# EAGLE schematic F14_01 copy (EAGLE 7.5.0)
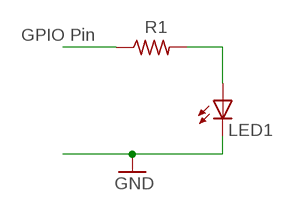
[diagram p0: schematic, sheet 1]

## Parts
LED1  LED-3MM-NO_SILK  [LED3MM-NS]
R1  R-US_0411/3V  [0411V]

## Nets
GND: LED1.K(C)
N$1: LED1.A R1.2
N$2: R1.1

## Notes on the sheet
- GPIO Pin

## Library data of the parts
LED1 = BOOK:LED: LEDs Standard schematic elements and footprints for 5mm, 3mm, 1206, and 0603 sized LEDs. 5mm - Spark Fun Electronics SKU : COM-00529 (and others)
R1 = BOOK:R-US_: RESISTOR, American symbol